# Altium schematic sheet TP_IHM_CONNECTOR.SchDoc
size A4
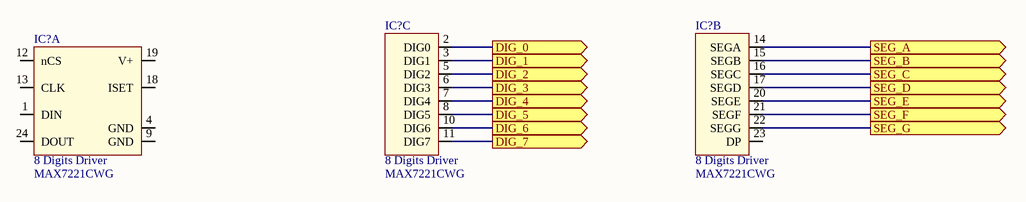
[diagram p0: TP_IHM_CONNECTOR.SchDoc]

## Parts
(Parts that share a designator on the sheet are numbered #1, #2 ... from top to bottom, then left to right.)
IC?#1  8 Digits Driver  [MAX7221CWG]  (part C of 3)
IC?#2  8 Digits Driver  [MAX7221CWG]  (part B of 3)
IC?#3  8 Digits Driver  [MAX7221CWG]  (part A of 3)

## Ports
DIG_0 (out), DIG_1 (out), DIG_2 (out), DIG_3 (out), DIG_4 (out), DIG_5 (out), DIG_6 (out), DIG_7 (out), SEG_A (out), SEG_B (out), SEG_C (out), SEG_D (out), SEG_E (out), SEG_F (out), SEG_G (out)

## Nets
DIG_0: IC?#1.2(DIG0) ; port DIG_0
DIG_1: IC?#1.3(DIG1) ; port DIG_1
DIG_2: IC?#1.5(DIG2) ; port DIG_2
DIG_3: IC?#1.6(DIG3) ; port DIG_3
DIG_4: IC?#1.7(DIG4) ; port DIG_4
DIG_5: IC?#1.8(DIG5) ; port DIG_5
DIG_6: IC?#1.10(DIG6) ; port DIG_6
DIG_7: IC?#1.11(DIG7) ; port DIG_7
SEG_A: IC?#2.14(SEGA) ; port SEG_A
SEG_B: IC?#2.15(SEGB) ; port SEG_B
SEG_C: IC?#2.16(SEGC) ; port SEG_C
SEG_D: IC?#2.17(SEGD) ; port SEG_D
SEG_E: IC?#2.20(SEGE) ; port SEG_E
SEG_F: IC?#2.21(SEGF) ; port SEG_F
SEG_G: IC?#2.22(SEGG) ; port SEG_G

Not connected (* = marked no-connect by the designer): IC?#2 23(DP); IC?#3 1(DIN) 4(GND) 9(GND) 12(nCS) 13(CLK) 18(ISET) 19(V+) 24(DOUT)

## Library data of the parts
IC?#1-IC?#3 = MAX7221: MAX7221 8 Digit 7 Segments Display; Reference: MAX7221CWG